# Altium schematic sheet WaveGenerator.SchDoc
size A; SheetNumber: 1; SheetTotal: 1
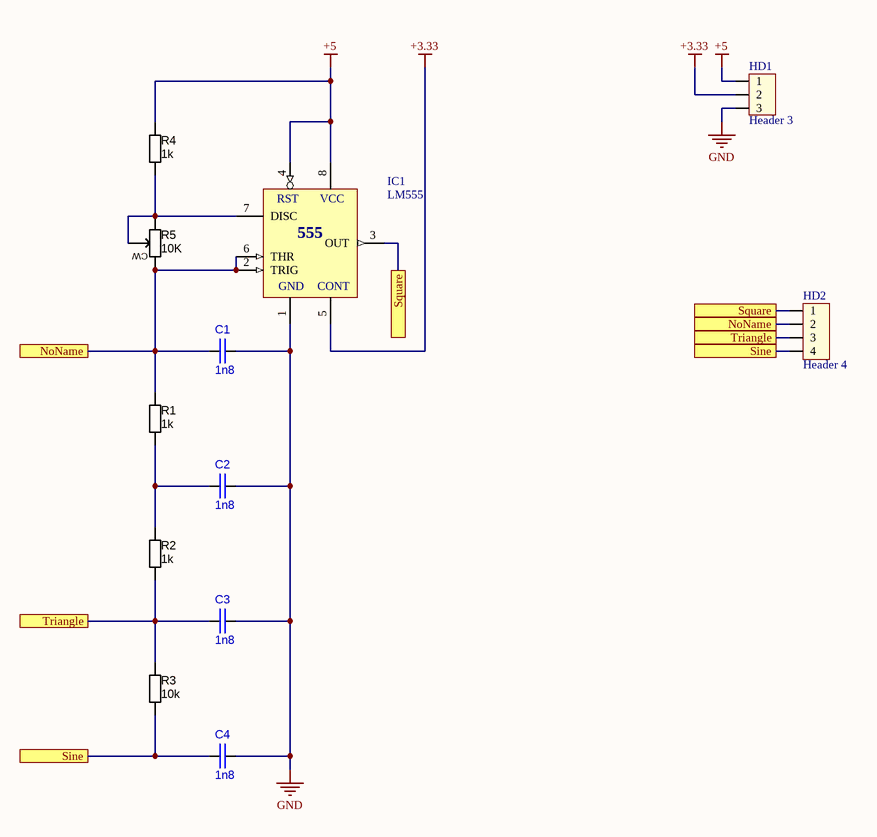
[diagram p0: WaveGenerator.SchDoc]

## Parts
C1  value 1n8  [CAPC2012X135N]  (hidden comment: approved sub OK)
C2  value 1n8  [CAPC2012X135N]  (hidden comment: approved sub OK)
C3  value 1n8  [CAPC2012X135N]  (hidden comment: approved sub OK)
C4  value 1n8  [CAPC2012X135N]  (hidden comment: approved sub OK)
HD1  Header 3  [HED3]
HD2  Header 4  [HED4]
IC1  LM555  [DIP8/W0.3]
R1  value 1k  [RESC2012N_ZERO]  (hidden comment: Jumper)
R2  value 1k  [RESC2012N_ZERO]  (hidden comment: Jumper)
R3  value 10k  [RESC2012N_ZERO]  (hidden comment: Jumper)
R4  value 1k  [RESC2012N_ZERO]  (hidden comment: Jumper)
R5  value 10K  [TRIMPOT_THT_PV36X]  (hidden comment: 25 turns)

## Ports
NoName, Sine, Square, Triangle

## Nets
+3.33: HD1.2 IC1.5(CONT)
+5: HD1.1 IC1.4(RST) IC1.8(VCC) R4.1
GND: C1.2 C2.2 C3.2 C4.2 HD1.3 IC1.1(GND)
NoName: C1.1 HD2.2 IC1.2(TRIG) IC1.6(THR) R1.1 R5.CW ; port NoName
Sine: C4.1 HD2.4 R3.2 ; port Sine
Square: HD2.1 IC1.3(OUT) ; port Square
Triangle: C3.1 HD2.3 R2.2 R3.1 ; port Triangle
NetC2_1: C2.1 R1.2 R2.1
NetIC1_7: IC1.7(DISC) R4.2 R5.CCW R5.W

## Notes on the sheet
- (in symbol LM555) 555

## Library data of the parts
C1-C4 = CAP C_0805: Capacitor SMD Cer 1.8nF 10% 50V X7R 0805; Manufacturer 1: AVX Corporation; Manufacturer Part Number 1: 08055C182KAT2A; Ratings: 50V; X7R; SCDType: source*; Tolerance: ±10%; Operating Temperature: -55°C ~ 125°C; Package / Case: 0805 (2012 metric); Supplier 1: Digi-Key; Supplier Part Number 1: 478-1374-1-ND
HD1 = Header 3: Header 3 (Green); Value: Header 3
HD2 = Header 4: Header 4 (Green); Value: Header 4
IC1 = LM555: Timer; Value: LM555
R1-R4 = RES_0805: Resistor SMD chip 0.0 Ohm 0.125W 0805; Manufacturer 1: Samsung Electro-Mechanics America, Inc; Manufacturer Part Number 1: RC2012J000CS; Ratings: 1/8W; SCDType: spec; Tolerance: N/A; Package / Case: 0805 (2012 metric); Supplier 1: Digi-Key; Supplier Part Number 1: 1276-5466-6-ND; RoHS 1: RoHS Compliant; ComponentLink1URL: http://www.samsungsem.com/servlet/FileDownload?filename=productcatalog/pdf/Chip_Resistor.pdf; ComponentLink1Description: http://www.samsungsem.com/servlet/FileDownload?filename=productcatalog/pdf/Chip_Resistor.pdf; Supplier 2: Digi-Key; Supplier Part Number 2: RMCF0805ZT0R00DKR-ND; Manufacturer 2: Stackpole Electronics Inc; Manufacturer Part Number 2: RMCF0805ZT0R00; RoHS 2: RoHS Compliant; ComponentLink2URL: http://www.seielect.com/Catalog/SEI-RMCF_RMCP.pdf; ComponentLink2Description: http://www.seielect.com/Catalog/SEI-RMCF_RMCP.pdf; Supplier 3: Digi-Key; Supplier Part Number 3: 311-0.0ARDKR-ND; Manufacturer 3: Yageo; Manufacturer Part Number 3: RC0805JR-070RL; RoHS 3: RoHS Compliant; ComponentLink3URL: http://media.digikey.com/pdf/Data%20Sheets/Yageo%20PDFs/RC0805%20Pb%20Free.pdf; ComponentLink3Description: http://media.digikey.com/pdf/Data%20Sheets/Yageo%20PDFs/RC0805%20Pb%20Free.pdf; Supplier 4: Digi-Key; Supplier Part Number 4: P0.0ADKR-ND; Manufacturer 4: Panasonic Electronic Components; Manufacturer Part Number 4: ERJ-6GEY0R00V; RoHS 4: RoHS Compliant; ComponentLink4URL: http://industrial.panasonic.com/www-cgi/jvcr13pz.cgi?E+PZ+3+AOA0001+ERJ6GEY0R00V+7+WW; ComponentLink4Description: http://industrial.panasonic.com/www-cgi/jvcr13pz.cgi?E+PZ+3+AOA0001+ERJ6GEY0R00V+7+WW; Supplier 5: Digi-Key; Supplier Part Number 5: RHM0.0CPDKR-ND; Manufacturer 5: Rohm Semiconductor; Manufacturer Part Number 5: MCR10ERTJ000; RoHS 5: RoHS Compliant; ComponentLink5URL: http://rohmfs.rohm.com/en/products/databook/datasheet/passive/resistor/chip_resistor/mcr_g.pdf; ComponentLink5Description: http://rohmfs.rohm.com/en/products/databook/datasheet/passive/resistor/chip_resistor/mcr_g.pdf
R5 = RES_TRIMMER_10K_25T_THT: Trimmer THD 10K 500mW 25-turn; Manufacturer 1: Murata Electronics North America; Manufacturer Part Number 1: PV36X103C01B00; Tolerance: ±10%; Ratings: 1/2W; ±100ppm/°C; SCDType: spec; Material: Cermet; Package / Case: 10.9mm L x 5.0mm W x 10.0mm H; Supplier 1: Digi-Key; Supplier Part Number 1: 490-2894-ND